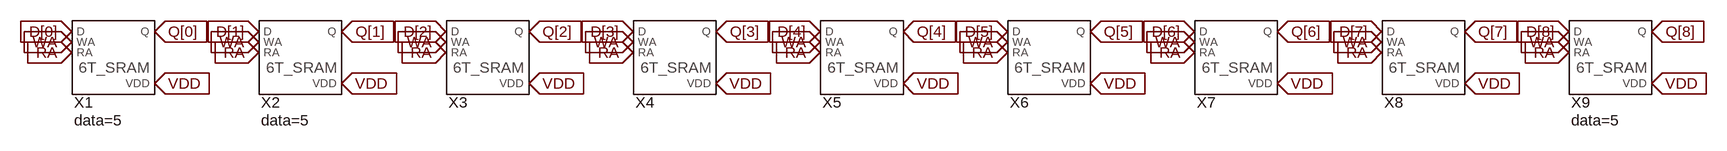
[diagram p0: schematic 6TSRAM[9].asc]
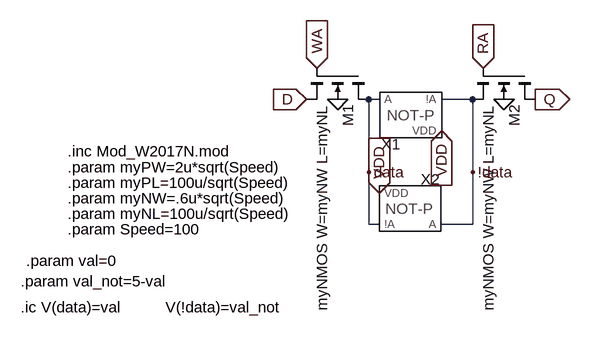
[diagram p1: sub-circuit 6tsram.asc]
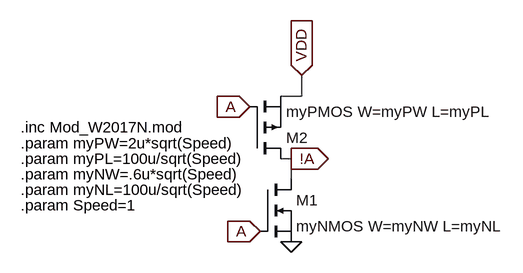
[diagram p2: sub-circuit gate_not_param.asc]
6TSRAM[9].asc, the LTspice schematic file:
Version 4
SHEET 1 1796 680
FLAG -624 -272 VDD
IOPIN -624 -272 In
FLAG -624 -352 Q[0]
IOPIN -624 -352 In
FLAG -752 -352 D[0]
IOPIN -752 -352 In
FLAG -752 -336 WA
IOPIN -752 -336 In
FLAG -752 -320 RA
IOPIN -752 -320 In
FLAG -336 -272 VDD
IOPIN -336 -272 In
FLAG -336 -352 Q[1]
IOPIN -336 -352 In
FLAG -464 -352 D[1]
IOPIN -464 -352 In
FLAG -464 -336 WA
IOPIN -464 -336 In
FLAG -464 -320 RA
IOPIN -464 -320 In
FLAG -48 -272 VDD
IOPIN -48 -272 In
FLAG -48 -352 Q[2]
IOPIN -48 -352 In
FLAG -176 -352 D[2]
IOPIN -176 -352 In
FLAG -176 -336 WA
IOPIN -176 -336 In
FLAG -176 -320 RA
IOPIN -176 -320 In
FLAG 240 -272 VDD
IOPIN 240 -272 In
FLAG 240 -352 Q[3]
IOPIN 240 -352 In
FLAG 112 -352 D[3]
IOPIN 112 -352 In
FLAG 112 -336 WA
IOPIN 112 -336 In
FLAG 112 -320 RA
IOPIN 112 -320 In
FLAG 528 -272 VDD
IOPIN 528 -272 In
FLAG 528 -352 Q[4]
IOPIN 528 -352 In
FLAG 400 -352 D[4]
IOPIN 400 -352 In
FLAG 400 -336 WA
IOPIN 400 -336 In
FLAG 400 -320 RA
IOPIN 400 -320 In
FLAG 816 -272 VDD
IOPIN 816 -272 In
FLAG 816 -352 Q[5]
IOPIN 816 -352 In
FLAG 688 -352 D[5]
IOPIN 688 -352 In
FLAG 688 -336 WA
IOPIN 688 -336 In
FLAG 688 -320 RA
IOPIN 688 -320 In
FLAG 1104 -272 VDD
IOPIN 1104 -272 In
FLAG 1104 -352 Q[6]
IOPIN 1104 -352 In
FLAG 976 -352 D[6]
IOPIN 976 -352 In
FLAG 976 -336 WA
IOPIN 976 -336 In
FLAG 976 -320 RA
IOPIN 976 -320 In
FLAG 1392 -272 VDD
IOPIN 1392 -272 In
FLAG 1392 -352 Q[7]
IOPIN 1392 -352 In
FLAG 1264 -352 D[7]
IOPIN 1264 -352 In
FLAG 1264 -336 WA
IOPIN 1264 -336 In
FLAG 1264 -320 RA
IOPIN 1264 -320 In
FLAG 1680 -272 VDD
IOPIN 1680 -272 In
FLAG 1680 -352 Q[8]
IOPIN 1680 -352 In
FLAG 1552 -352 D[8]
IOPIN 1552 -352 In
FLAG 1552 -336 WA
IOPIN 1552 -336 In
FLAG 1552 -320 RA
IOPIN 1552 -320 In
SYMBOL 6TSRAM -704 -320 R0
WINDOW 39 -44 105 Left 2
SYMATTR InstName X1
SYMATTR SpiceLine data=5
SYMBOL 6TSRAM -416 -320 R0
WINDOW 39 -44 105 Left 2
SYMATTR InstName X2
SYMATTR SpiceLine data=5
SYMBOL 6TSRAM -128 -320 R0
SYMATTR InstName X3
SYMBOL 6TSRAM 160 -320 R0
SYMATTR InstName X4
SYMBOL 6TSRAM 448 -320 R0
SYMATTR InstName X5
SYMBOL 6TSRAM 736 -320 R0
SYMATTR InstName X6
SYMBOL 6TSRAM 1024 -320 R0
SYMATTR InstName X7
SYMBOL 6TSRAM 1312 -320 R0
SYMATTR InstName X8
SYMBOL 6TSRAM 1600 -320 R0
WINDOW 39 -44 105 Left 2
SYMATTR InstName X9
SYMATTR SpiceLine data=5

6tsram.asc, the sub-circuit schematic file:
Version 4
SHEET 1 880 680
WIRE 16 -64 0 -64
WIRE 160 -64 112 -64
WIRE 0 48 0 -64
WIRE 160 48 160 -64
WIRE 0 128 0 48
WIRE 16 128 0 128
WIRE 160 128 160 48
WIRE 160 128 112 128
FLAG 112 -16 VDD
IOPIN 112 -16 In
FLAG 16 80 VDD
IOPIN 16 80 In
FLAG 256 -64 Q
IOPIN 256 -64 Out
FLAG 208 -64 0
FLAG -48 -64 0
FLAG -80 -112 WA
IOPIN -80 -112 In
FLAG 176 -112 RA
IOPIN 176 -112 In
FLAG -96 -64 D
IOPIN -96 -64 In
FLAG 0 48 data
FLAG 160 48 !data
SYMBOL Gate_NOT_PARAM 64 -32 R0
SYMATTR InstName X1
SYMBOL Gate_NOT_PARAM 64 96 R180
SYMATTR InstName X2
SYMBOL nmos4 0 -112 R90
SYMATTR InstName M1
SYMATTR Value myNMOS W=myNW L=myNL
SYMBOL nmos4 256 -112 R90
SYMATTR InstName M2
SYMATTR Value myNMOS W=myNW L=myNL
TEXT -464 16 Left 2 !.inc Mod_W2017N.mod
TEXT -464 40 Left 2 !.param myPW=2u*sqrt(Speed)
TEXT -464 64 Left 2 !.param myPL=100u/sqrt(Speed)
TEXT -464 88 Left 2 !.param myNW=.6u*sqrt(Speed)
TEXT -464 112 Left 2 !.param myNL=100u/sqrt(Speed)
TEXT -464 136 Left 2 !.param Speed=100
TEXT -536 216 Left 2 !.param val_not=5-val
TEXT -536 256 Left 2 !.ic V(data)=val          V(!data)=val_not
TEXT -528 184 Left 2 !.param val=0

gate_not_param.asc, the sub-circuit schematic file:
Version 4
SHEET 1 880 680
WIRE 64 -112 64 -144
WIRE 64 -112 32 -112
WIRE 48 -16 32 -16
WIRE 48 16 48 -16
FLAG 48 -16 !A
IOPIN 48 -16 Out
FLAG 64 -144 VDD
IOPIN 64 -144 In
FLAG 48 112 0
FLAG 0 96 A
IOPIN 0 96 In
FLAG -16 -96 A
IOPIN -16 -96 In
SYMBOL nmos 0 16 R0
SYMATTR InstName M1
SYMATTR Value myNMOS W=myNW L=myNL
SYMBOL pmos -16 -16 M180
SYMATTR InstName M2
SYMATTR Value myPMOS W=myPW L=myPL
TEXT -368 -64 Left 2 !.inc Mod_W2017N.mod
TEXT -368 -40 Left 2 !.param myPW=2u*sqrt(Speed)
TEXT -368 -16 Left 2 !.param myPL=100u/sqrt(Speed)
TEXT -368 8 Left 2 !.param myNW=.6u*sqrt(Speed)
TEXT -368 32 Left 2 !.param myNL=100u/sqrt(Speed)
TEXT -368 56 Left 2 !.param Speed=1

The netlist it stands for:
* 6TSRAM[9].asc
XX1 D[0] VDD Q[0] RA WA 6tsram params: data=5
XX2 D[1] VDD Q[1] RA WA 6tsram params: data=5
XX3 D[2] VDD Q[2] RA WA 6tsram
XX4 D[3] VDD Q[3] RA WA 6tsram
XX5 D[4] VDD Q[4] RA WA 6tsram
XX6 D[5] VDD Q[5] RA WA 6tsram
XX7 D[6] VDD Q[6] RA WA 6tsram
XX8 D[7] VDD Q[7] RA WA 6tsram
XX9 D[8] VDD Q[8] RA WA 6tsram params: data=5

* block symbol definitions
.subckt 6tsram D VDD Q RA WA
XX1 data VDD !data gate_not_param
XX2 !data VDD data gate_not_param
M1 data WA D 0 myNMOS W=myNW L=myNL
M2 Q RA !data 0 myNMOS W=myNW L=myNL
.inc Mod_W2017N.mod
.param myPW=2u*sqrt(Speed)
.param myPL=100u/sqrt(Speed)
.param myNW=.6u*sqrt(Speed)
.param myNL=100u/sqrt(Speed)
.param Speed=100
.param val_not=5-val
.ic V(data)=val          V(!data)=val_not
.param val=0
.ends 6tsram

.subckt gate_not_param A VDD !A
M1 !A A 0 0 myNMOS W=myNW L=myNL
M2 !A A VDD VDD myPMOS W=myPW L=myPL
.inc Mod_W2017N.mod
.param myPW=2u*sqrt(Speed)
.param myPL=100u/sqrt(Speed)
.param myNW=.6u*sqrt(Speed)
.param myNL=100u/sqrt(Speed)
.param Speed=1
.ends gate_not_param

.model NMOS NMOS
.model PMOS PMOS
.lib standard.mos
.backanno
.end